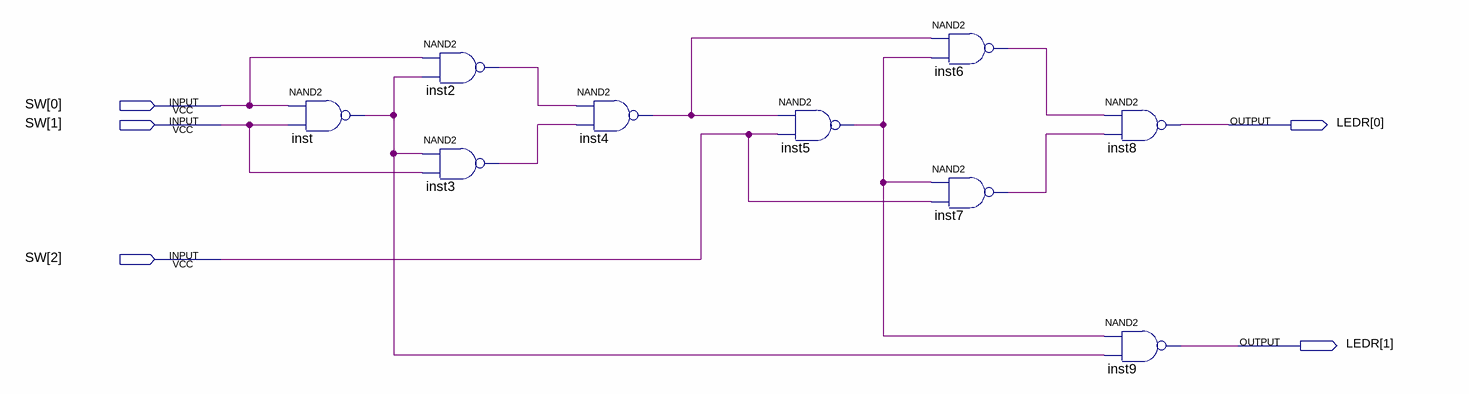
[diagram p0: schematic sheet]
// Quartus schematic full_adder.bdf as structural Verilog: 9 symbols, 5 pins
module full_adder (
  input  [2:0] SW,
  output [1:0] LEDR
);

  wire inst2_out, inst3_out, inst4_out, inst5_out, inst6_out, inst7_out, inst_out;

  nand inst (inst_out, SW[0], SW[1]);
  nand inst2 (inst2_out, SW[0], inst_out);
  nand inst3 (inst3_out, inst_out, SW[1]);
  nand inst4 (inst4_out, inst2_out, inst3_out);
  nand inst5 (inst5_out, inst4_out, SW[2]);
  nand inst6 (inst6_out, inst4_out, inst5_out);
  nand inst7 (inst7_out, inst5_out, SW[2]);
  nand inst8 (LEDR[0], inst6_out, inst7_out);
  nand inst9 (LEDR[1], inst5_out, inst_out);
endmodule
